# Altium schematic sheet CONNECTORs.SchDoc
size A4
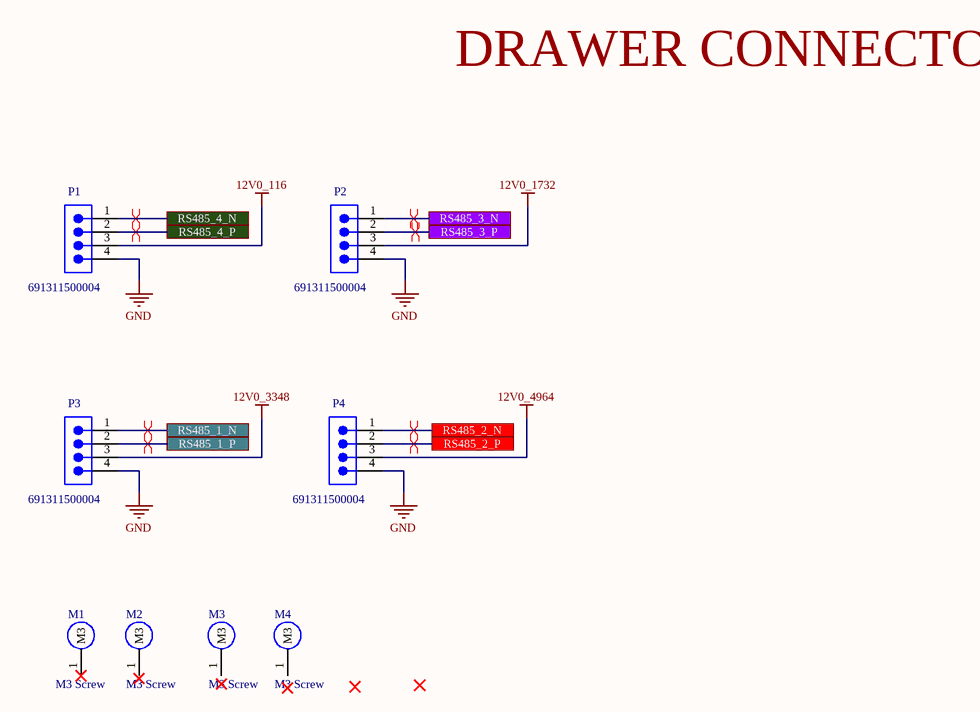
[diagram p0: CONNECTORs.SchDoc]

## Parts
M1  M3 Screw  [M3_Screw]
M2  M3 Screw  [M3_Screw]
M3  M3 Screw  [M3_Screw]
M4  M3 Screw  [M3_Screw]
P1  691311500004  [691311500004]
P2  691311500004  [691311500004]
P3  691311500004  [691311500004]
P4  691311500004  [691311500004]

## Ports
RS485_1_N, RS485_1_P, RS485_2_N, RS485_2_P, RS485_3_N, RS485_3_P, RS485_4_N, RS485_4_P

## Nets
12V0_116: P1.3
12V0_1732: P2.3
12V0_3348: P3.3
12V0_4964: P4.3
GND: P1.4 P2.4 P3.4 P4.4
RS485_1_N: P3.1 ; port RS485_1_N
RS485_1_P: P3.2 ; port RS485_1_P
RS485_2_N: P4.1 ; port RS485_2_N
RS485_2_P: P4.2 ; port RS485_2_P
RS485_3_N: P2.1 ; port RS485_3_N
RS485_3_P: P2.2 ; port RS485_3_P
RS485_4_N: P1.1 ; port RS485_4_N
RS485_4_P: P1.2 ; port RS485_4_P

Not connected (* = marked no-connect by the designer): M1 1(M3)*; M2 1(M3); M3 1(M3); M4 1(M3)

## Layout directives
differential pair: RS485_1_N, RS485_1_P, RS485_2_N, RS485_2_P, RS485_3_N, RS485_3_P, RS485_4_N, RS485_4_P

## Notes on the sheet
- DRAWER CONNECTORs

## Library data of the parts
M1 = M3 Screw: M3 Screw Hole; Place: POP
M2-M4 = M3 Screw: M3 Screw Hole; Place: DNP
P1-P4 = 691311500004: WR-TBL Series 311 Open Vertical PCB Header, THT, pitch 5.08mm, 04p; Manufacturer Part Number: SBDK 5,08-E2A/4; Manufacturer: Wurth Elektronik; Modularity: No; Rated Current: 20A; System: Pluggable Connector; Working Voltage: 300V; Category: Terminal Block; Match Code: WR-TBL; ComponentLink1Description: Website Link; ComponentLink1URL: https://www.we-online.com/redexpert/article/691311500004?ad; ComponentLink2Description: Datasheet Link; ComponentLink2URL: https://www.we-online.com/redexpert/spec/691311500004?ad; Mount: Through Hole; Min Operating Temperature: -40°C; Max Operating Temperature: 105°C; Packaging: Box; Application: Pluggable; Number of Pins: 4; Number of Rows: 1; Orientation: Vertical; Pitch: 5.08mm